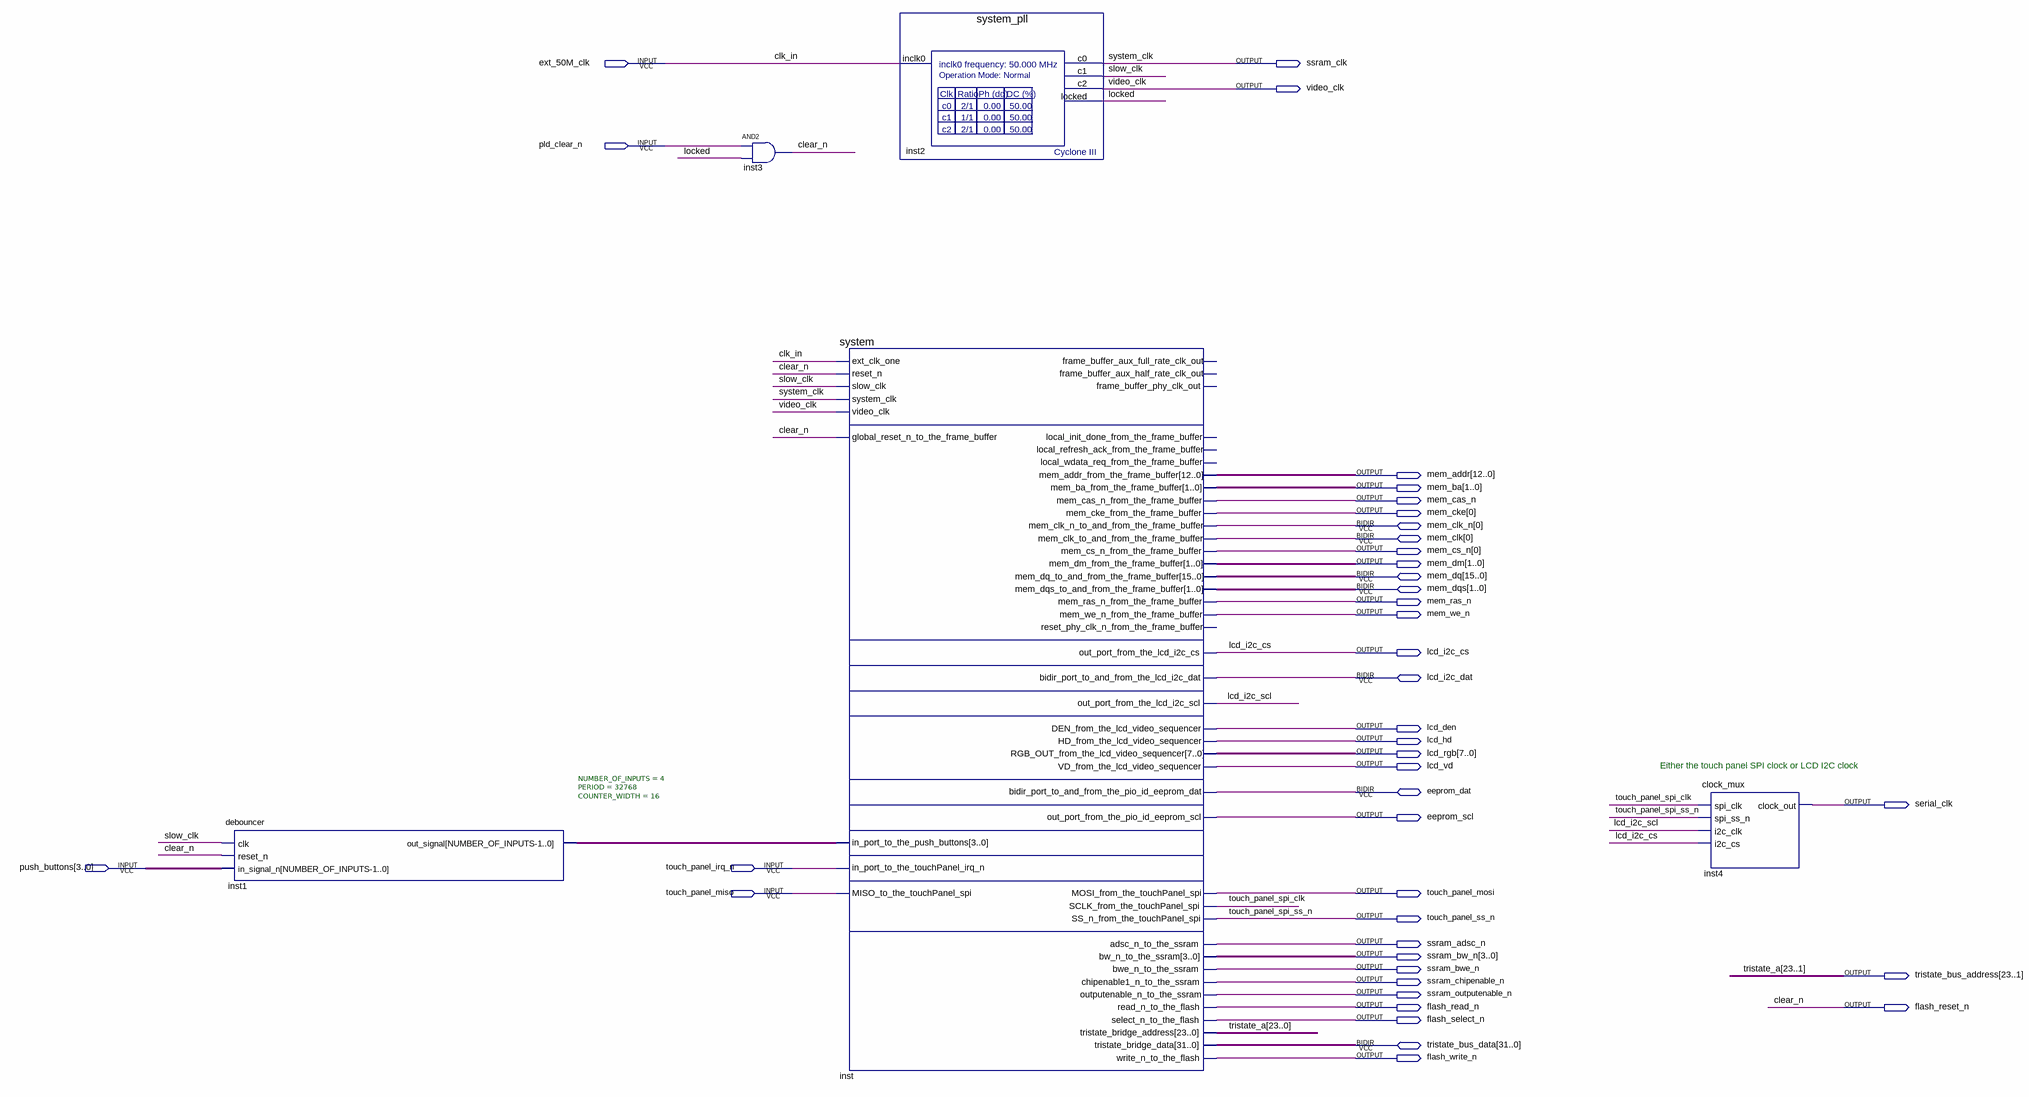
[diagram p0: schematic sheet]
// Quartus schematic C2H_Mandelbrot.bdf as structural Verilog: 5 symbols, 41 pins
module C2H_Mandelbrot (
  input  ext_50M_clk,
  input  pld_clear_n,
  input  [3:0] push_buttons,
  input  touch_panel_irq_n,
  input  touch_panel_miso,
  inout  [0:0] mem_clk_n,
  inout  [0:0] mem_clk,
  inout  [15:0] mem_dq,
  inout  [1:0] mem_dqs,
  inout  lcd_i2c_dat,
  inout  eeprom_dat,
  inout  [31:0] tristate_bus_data,
  output ssram_clk,
  output video_clk,
  output [12:0] mem_addr,
  output [1:0] mem_ba,
  output mem_cas_n,
  output [0:0] mem_cke,
  output [0:0] mem_cs_n,
  output [1:0] mem_dm,
  output mem_ras_n,
  output mem_we_n,
  output lcd_i2c_cs,
  output lcd_den,
  output lcd_hd,
  output [7:0] lcd_rgb,
  output lcd_vd,
  output serial_clk,
  output eeprom_scl,
  output touch_panel_mosi,
  output touch_panel_ss_n,
  output ssram_adsc_n,
  output [3:0] ssram_bw_n,
  output ssram_bwe_n,
  output [23:1] tristate_bus_address,
  output ssram_chipenable_n,
  output ssram_outputenable_n,
  output flash_read_n,
  output flash_reset_n,
  output flash_select_n,
  output flash_write_n
);

  wire lcd_i2c_scl, locked, slow_clk, touch_panel_spi_clk;
  wire [0:0] tristate_a;
  wire [3:0] inst1_out_signal;

  debouncer #(.NUMBER_OF_INPUTS(4), .PERIOD(32768), .COUNTER_WIDTH(16)) inst1 (
    .clk(slow_clk), .reset_n(flash_reset_n), .in_signal_n(push_buttons), .out_signal(inst1_out_signal));
  and inst3 (flash_reset_n, pld_clear_n, locked);
  system inst (
    .ext_clk_one(ext_50M_clk), .reset_n(flash_reset_n), .slow_clk(slow_clk), .system_clk(ssram_clk),
    .video_clk(video_clk), .global_reset_n_to_the_frame_buffer(flash_reset_n),
    .in_port_to_the_push_buttons(inst1_out_signal), .in_port_to_the_touchPanel_irq_n(touch_panel_irq_n),
    .MISO_to_the_touchPanel_spi(touch_panel_miso), .mem_addr_from_the_frame_buffer(mem_addr),
    .mem_ba_from_the_frame_buffer(mem_ba), .mem_cas_n_from_the_frame_buffer(mem_cas_n),
    .mem_cke_from_the_frame_buffer(mem_cke[0]), .mem_cs_n_from_the_frame_buffer(mem_cs_n[0]),
    .mem_dm_from_the_frame_buffer(mem_dm), .mem_ras_n_from_the_frame_buffer(mem_ras_n),
    .mem_we_n_from_the_frame_buffer(mem_we_n), .out_port_from_the_lcd_i2c_cs(lcd_i2c_cs),
    .out_port_from_the_lcd_i2c_scl(lcd_i2c_scl), .DEN_from_the_lcd_video_sequencer(lcd_den),
    .HD_from_the_lcd_video_sequencer(lcd_hd), .RGB_OUT_from_the_lcd_video_sequencer(lcd_rgb),
    .VD_from_the_lcd_video_sequencer(lcd_vd), .out_port_from_the_pio_id_eeprom_scl(eeprom_scl),
    .MOSI_from_the_touchPanel_spi(touch_panel_mosi), .SCLK_from_the_touchPanel_spi(touch_panel_spi_clk),
    .SS_n_from_the_touchPanel_spi(touch_panel_ss_n), .adsc_n_to_the_ssram(ssram_adsc_n),
    .bw_n_to_the_ssram(ssram_bw_n), .bwe_n_to_the_ssram(ssram_bwe_n),
    .chipenable1_n_to_the_ssram(ssram_chipenable_n), .outputenable_n_to_the_ssram(ssram_outputenable_n),
    .read_n_to_the_flash(flash_read_n), .select_n_to_the_flash(flash_select_n),
    .tristate_bridge_address({tristate_bus_address, tristate_a[0]}), .write_n_to_the_flash(flash_write_n),
    .mem_clk_n_to_and_from_the_frame_buffer(mem_clk_n[0]), .mem_clk_to_and_from_the_frame_buffer(mem_clk[0]),
    .mem_dq_to_and_from_the_frame_buffer(mem_dq), .mem_dqs_to_and_from_the_frame_buffer(mem_dqs),
    .bidir_port_to_and_from_the_lcd_i2c_dat(lcd_i2c_dat),
    .bidir_port_to_and_from_the_pio_id_eeprom_dat(eeprom_dat), .tristate_bridge_data(tristate_bus_data));  // open: frame_buffer_aux_full_rate_clk_out, frame_buffer_aux_half_rate_clk_out, frame_buffer_phy_clk_out, local_init_done_from_the_frame_buffer, local_refresh_ack_from_the_frame_buffer, local_wdata_req_from_the_frame_buffer, reset_phy_clk_n_from_the_frame_buffer
  system_pll inst2 (.inclk0(ext_50M_clk), .c0(ssram_clk), .c1(slow_clk), .c2(video_clk), .locked(locked));
  clock_mux inst4 (
    .spi_clk(touch_panel_spi_clk), .spi_ss_n(touch_panel_ss_n), .i2c_clk(lcd_i2c_scl), .i2c_cs(lcd_i2c_cs),
    .clock_out(serial_clk));

  // Other names for the same wires on the sheet: clear_n = flash_reset_n; clk_in = ext_50M_clk;
  //   system_clk = ssram_clk; touch_panel_spi_ss_n = touch_panel_ss_n; tristate_a[23:1] = tristate_bus_address

  // Notes on the sheet:
  //   Either the touch panel SPI clock or LCD I2C clock
endmodule
